# Altium project STM32F103C8T6.PrjPcb
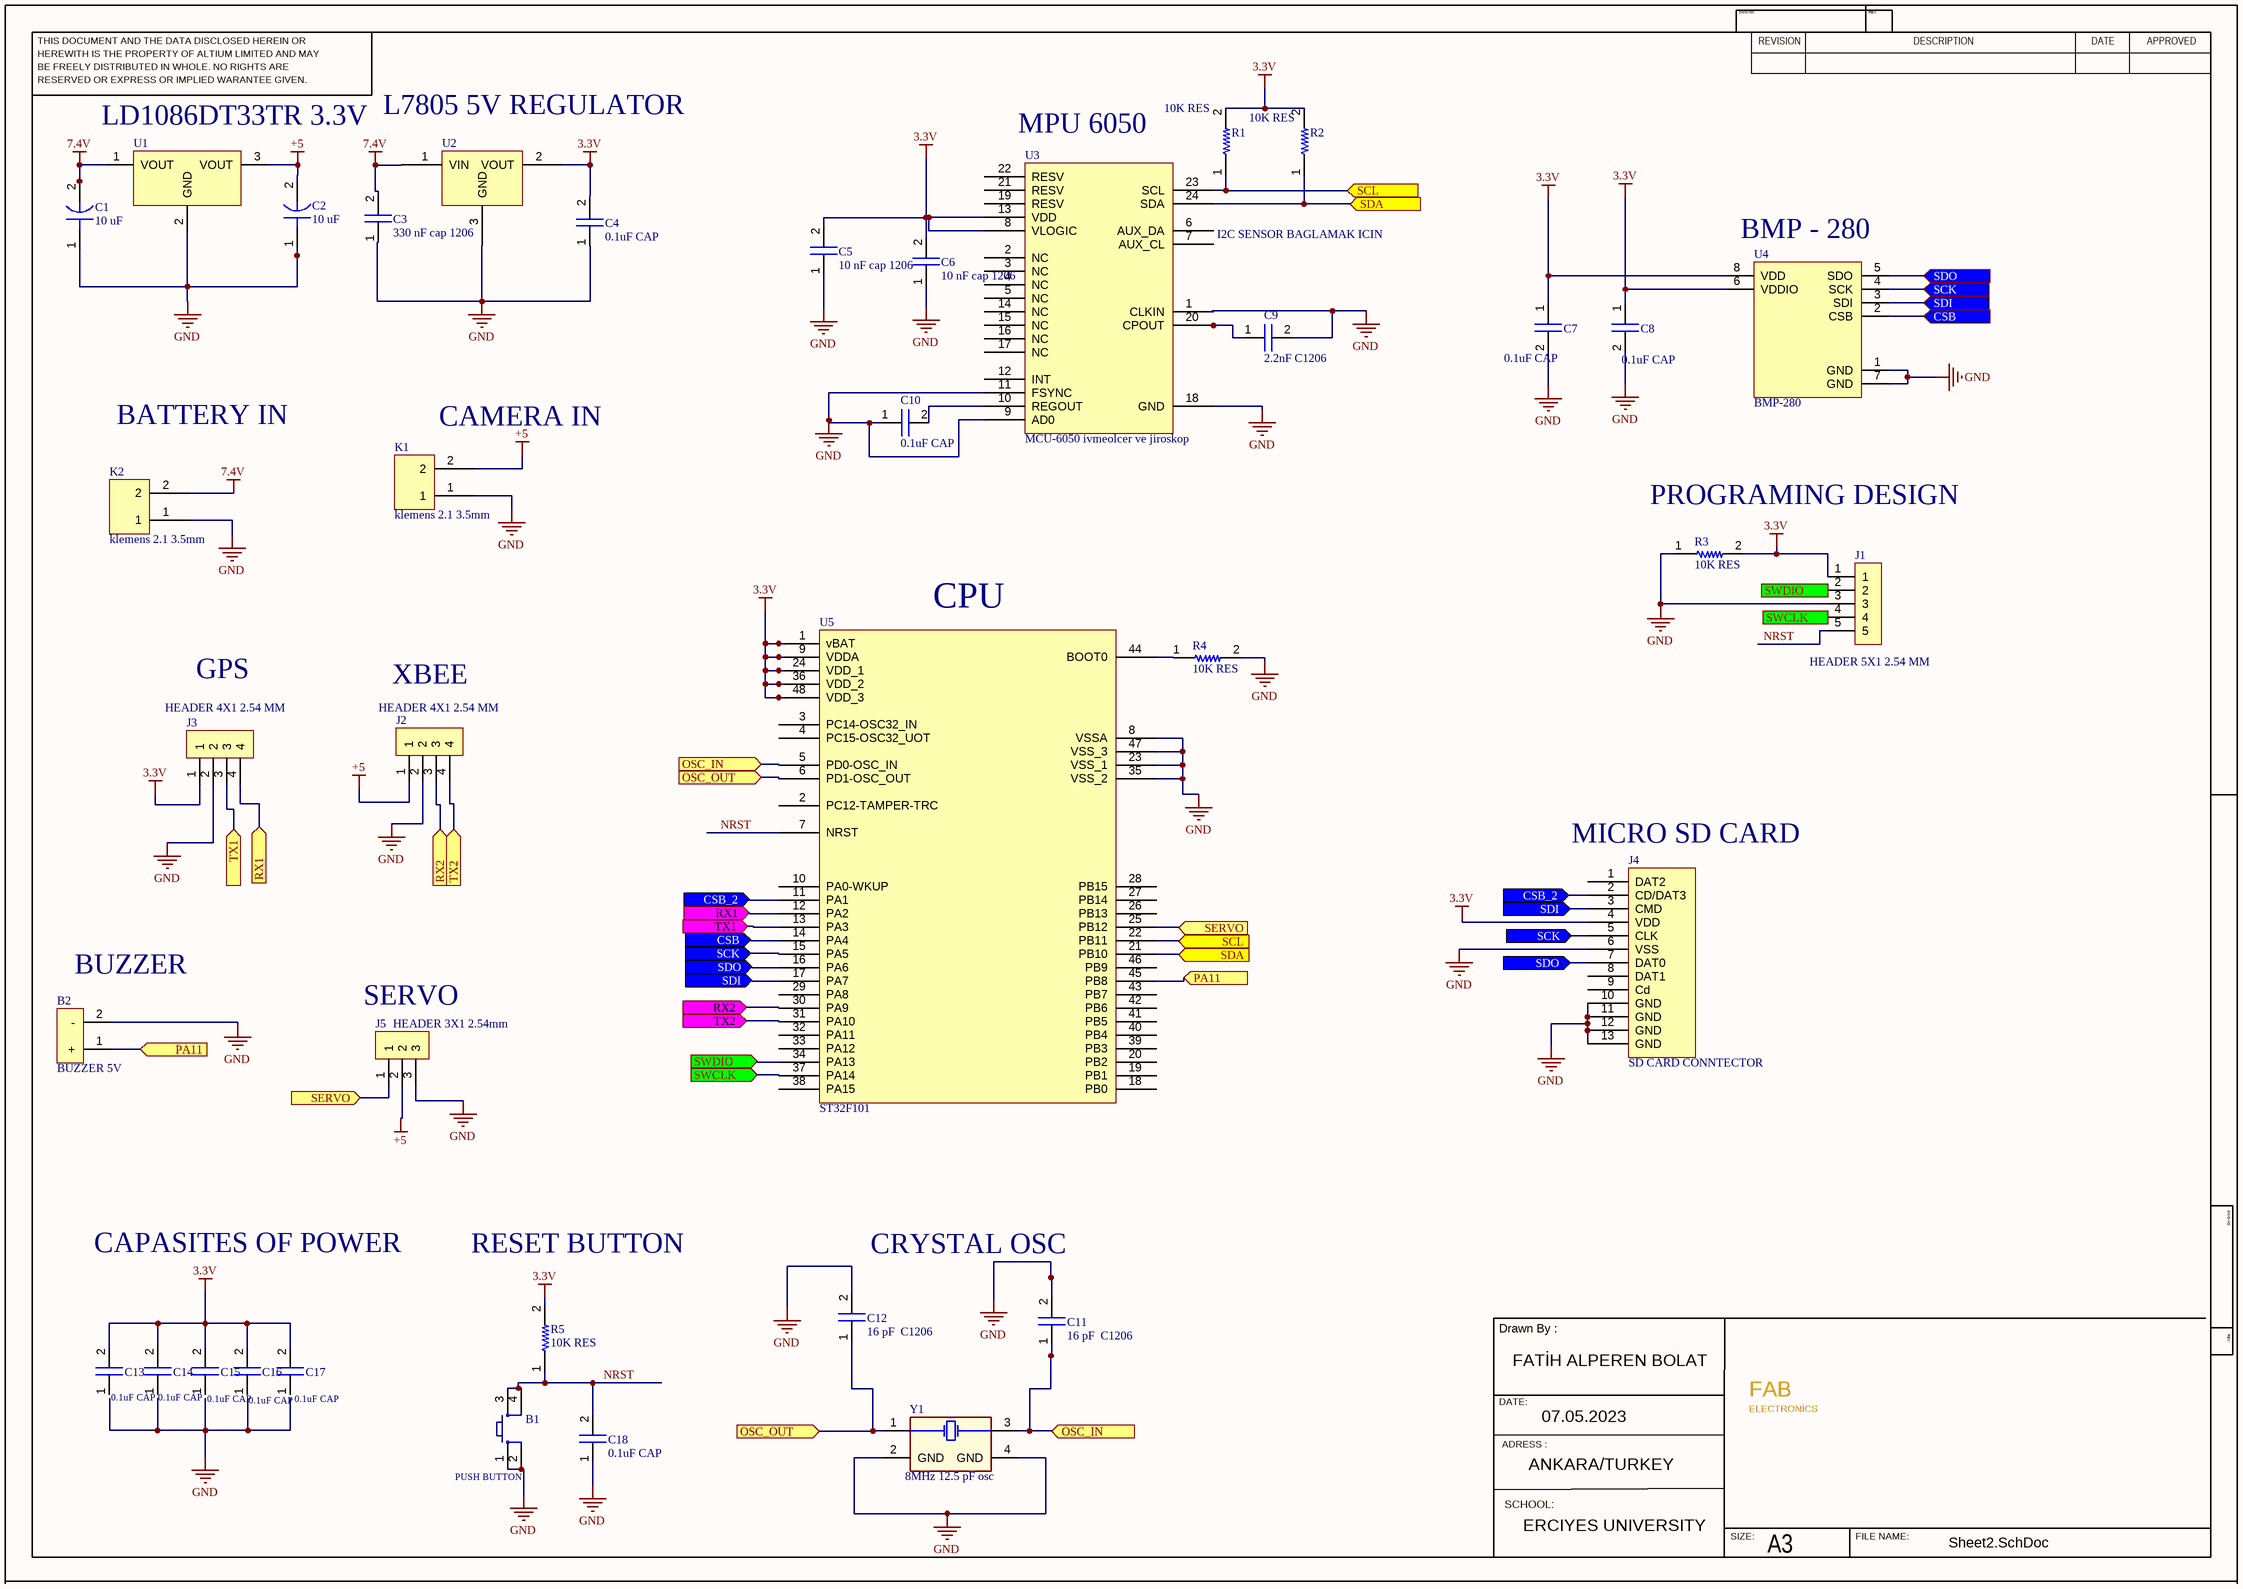
[diagram p0: Sheet2.SchDoc]
2 sheets, 38 parts. Net scope: flat (ports and power ports of the same name join across sheets).
Board file: PCB1.PcbDoc
Sheets:
  Sheet1.SchDoc
  Sheet2.SchDoc

## Sheet Sheet1.SchDoc
size 420 x 297 mm; Engineer: FATİH ALPEREN BOLAT; SheetNumber: 1; SheetTotal: 1

### Notes on the sheet
- THIS DOCUMENT AND THE DATA DISCLOSED HEREIN OR
- HEREWITH IS THE PROPERTY OF ALTIUM LIMITED AND MAY
- DWG NO:
- REVISION
- REV:
- DESCRIPTION
- DATE
- APPROVED
- BE FREELY DISTRIBUTED IN WHOLE. NO RIGHTS ARE
- RESERVED OR EXPRESS OR IMPLIED WARANTEE GIVEN.
- Drawn By :
- DATE:
- ELECTRONİCS
- FAB
- ADRESS :
- ANKARA/TURKEY
- 07.05.2023
- SCHOOL:
- ERCIYES UNIVERSITY
- SIZE:
- FILE NAME:
- A3

## Sheet Sheet2.SchDoc
size 420 x 297 mm; Engineer: FATİH ALPEREN BOLAT; SheetNumber: 2; SheetTotal: 2

### Parts
B1  PUSH BUTTON  [PUSH BUTON]
B2  BUZZER 5V  [BUZZER 5V]
C1  10 uF  [TANTAL CAP 1206 10 nF]
C2  10 uF  [TANTAL CAP 1206 10 nF]
C3  330 nF cap 1206  [CAP 1206 - 50V 0.1uF smd]
C4  0.1uF CAP  [CAP 1206 - 50V 0.1uF smd]
C5  10 nF cap 1206  [CAP 1206 - 50V 0.1uF smd]
C6  10 nF cap 1206  [CAP 1206 - 50V 0.1uF smd]
C7  0.1uF CAP  [CAP 1206 - 50V 0.1uF smd]
C8  0.1uF CAP  [CAP 1206 - 50V 0.1uF smd]
C9  2.2nF C1206  [CAP 1206 - 50V 0.1uF smd]
C10  0.1uF CAP  [CAP 1206 - 50V 0.1uF smd]
C11  16 pF  C1206  [CAP 1206 - 50V 0.1uF smd]
C12  16 pF  C1206  [CAP 1206 - 50V 0.1uF smd]
C13  0.1uF CAP  [CAP 1206 - 50V 0.1uF smd]
C14  0.1uF CAP  [CAP 1206 - 50V 0.1uF smd]
C15  0.1uF CAP  [CAP 1206 - 50V 0.1uF smd]
C16  0.1uF CAP  [CAP 1206 - 50V 0.1uF smd]
C17  0.1uF CAP  [CAP 1206 - 50V 0.1uF smd]
C18  0.1uF CAP  [CAP 1206 - 50V 0.1uF smd]
J1  HEADER 5X1 2.54 MM  [HEADER 5X1 2.54MM]
J2  HEADER 4X1 2.54 MM  [HEADER 4X1 2.54 MM]
J3  HEADER 4X1 2.54 MM  [HEADER 4X1 2.54 MM]
J4  SD CARD CONNTECTOR  [MICRO SD CARD]
J5  HEADER 3X1 2.54mm  [HEADER 2.54mm 3x1]
K1  klemens 2.1 3.5mm  [KLEMENS 1.2 3.5MM]
K2  klemens 2.1 3.5mm  [KLEMENS 1.2 3.5MM]
R1  10K RES  [RESISTORS]
R2  10K RES  [RESISTORS]
R3  10K RES  [RESISTORS]
R4  10K RES  [RESISTORS]
R5  10K RES  [RESISTORS]
U1  LD1086DT33TR 3.3V  [DPAK L7805CDT-TR]
U2  L7805 5V REGULATOR  [DPAK L7805CDT-TR]
U3  MCU-6050 ivmeolcer ve jiroskop  [MCU-6050 ivmeolcer ve jiroskop]
U4  BMP-280  [MPU-280 BASINC SENSOR]
U5  ST32F101  [LQFP48-STM32]
Y1  8MHz 12.5 pF osc  [8 MHz 12.5 pF OSC]

### Ports
CSB (in), CSB_2 (in), OSC_IN (in), OSC_OUT (in), PA11 (in), RX1 (in), RX2 (in), SCK (in), SCL (in), SDA (in), SDI (in), SDO (in), SERVO (in), SWCLK (in), SWDIO (in), TX1 (in), TX2 (in)

### Nets
3.3V: C4.2 C5.2 C6.2 C7.1 C8.1 C13.2 C14.2 C15.2 C16.2 C17.2 J1.1 J3.1 J4.4(VDD) R1.2 R2.2 R3.2 R5.2 U2.2(VOUT) U3.8(VLOGIC) U3.13(VDD) U4.6(VDDIO) U4.8(VDD) U5.1(vBAT) U5.9(VDDA) U5.24(VDD_1) U5.36(VDD_2) U5.48(VDD_3)
7.4V: C1.2 C3.2 K2.2 U1.1(VOUT) U2.1(VIN)
+5: C2.2 J2.1 J5.2 K1.2 U1.3(VOUT)
GND: B1.1 B1.2 B2.2(-) C1.1 C2.1 C3.1 C4.1 C5.1 C6.1 C7.2 C8.2 C9.2 C10.1 C11.2 C12.2 C18.1 J1.3 J2.2 J3.2 J4.6(VSS) J4.10(GND) J4.11(GND) J4.12(GND) J4.13(GND) J5.3 K1.1 K2.1 R3.1 R4.2 U1.2(GND) U2.3(GND) U3.9(AD0) U3.11(FSYNC) U3.18(GND) U4.1(GND) U4.7(GND) U5.8(VSSA) U5.23(VSS_1) U5.35(VSS_2) U5.47(VSS_3) Y1.2(GND) Y1.4(GND)
NRST: B1.3 B1.4 C18.2 J1.5 R5.1 U5.7(NRST)
NetB2_1: B2.1(+) U5.45(PB8) ; port PA11
NetC9_1: C9.1 U3.20(CPOUT)
NetC10_2: C10.2 U3.10(REGOUT)
NetC11_1: C11.1 U5.5(PD0-OSC_IN) Y1.3 ; port OSC_IN
NetC12_1: C12.1 U5.6(PD1-OSC_OUT) Y1.1 ; port OSC_OUT
NetJ1_2: J1.2 U5.34(PA13) ; port SWDIO
NetJ1_4: J1.4 U5.37(PA14) ; port SWCLK
NetJ2_3: J2.3 U5.30(PA9) ; port RX2
NetJ2_4: J2.4 U5.31(PA10) ; port TX2
NetJ3_3: J3.3 U5.13(PA3) ; port TX1
NetJ3_4: J3.4 U5.12(PA2) ; port RX1
NetJ4_2: J4.2(CD/DAT3) U5.11(PA1) ; port CSB_2
NetJ4_3: J4.3(CMD) U4.3(SDI) U5.17(PA7) ; port SDI
NetJ4_5: J4.5(CLK) U4.4(SCK) U5.15(PA5) ; port SCK
NetJ4_7: J4.7(DAT0) U4.5(SDO) U5.16(PA6) ; port SDO
NetJ5_1: J5.1 U5.25(PB12) ; port SERVO
NetR1_1: R1.1 U3.23(SCL) U5.22(PB11) ; port SCL
NetR2_1: R2.1 U3.24(SDA) U5.21(PB10) ; port SDA
NetR4_1: R4.1 U5.44(BOOT0)
NetU4_2: U4.2(CSB) U5.14(PA4) ; port CSB

Not connected (* = marked no-connect by the designer): C13 1; C14 1; C15 1; C16 1; C17 1; J4 1(DAT2) 8(DAT1) 9(Cd); U3 1(CLKIN) 2(NC) 3(NC) 4(NC) 5(NC) 6(AUX_DA) 7(AUX_CL) 12(INT) 14(NC) 15(NC) 16(NC) 17(NC) 19(RESV) 21(RESV) 22(RESV); U5 2(PC12-TAMPER-TRC) 3(PC14-OSC32_IN) 4(PC15-OSC32_UOT) 10(PA0-WKUP) 18(PB0) 19(PB1) 20(PB2) 26(PB13) 27(PB14) 28(PB15) 29(PA8) 32(PA11) 33(PA12) 38(PA15) 39(PB3) 40(PB4) 41(PB5) 42(PB6) 43(PB7) 46(PB9)

### Notes on the sheet
- (near U3) MPU 6050
- (near U3) I2C SENSOR BAGLAMAK ICIN
- (near U4) BMP - 280
- BATTERY IN
- (near K1) CAMERA IN
- PROGRAMING DESIGN
- (near U5) CPU
- GPS
- XBEE
- (near J4) MICRO SD CARD
- (near B2) BUZZER
- (near J5) SERVO
- CAPASITES OF POWER
- RESET BUTTON
- CRYSTAL OSC
- THIS DOCUMENT AND THE DATA DISCLOSED HEREIN OR
- HEREWITH IS THE PROPERTY OF ALTIUM LIMITED AND MAY
- DWG NO:
- REVISION
- REV:
- DESCRIPTION
- DATE
- APPROVED
- BE FREELY DISTRIBUTED IN WHOLE. NO RIGHTS ARE
- RESERVED OR EXPRESS OR IMPLIED WARANTEE GIVEN.
- Drawn By :
- DATE:
- ELECTRONİCS
- FAB
- ADRESS :
- ANKARA/TURKEY
- 07.05.2023
- SCHOOL:
- ERCIYES UNIVERSITY
- SIZE:
- FILE NAME:
- A3

### Library data of the parts
C1 C2 = cap1206 tantal 10 uF
C4 C7 C8 C10 C13-C18 = 0.1 uF  CAP1206
J4 = SD CARD
U1 = LD1086DT33TR 3.3 REGULATOR
U2 = L7805 5V REGULATOR: L7805 5V REGULATOR SMD DPACK
U4 = BMP-280: BASINC SENSORU / https://ozdisan.com/optolar-ve-sensorler/sensorler/basinc-sensorleri/BMP280?gclid=Cj0KCQjwmZejBhC_ARIsAGhCqndlij6IrBOvBeDoWfjz10s7tOHoGpSsfqmzCZxfY9KOK81rPqgoNswaAu1REALw_wcB
U5 = ST32F101: STM32 LQFP48 40 PİNLİ MIKROİŞLEMCİ